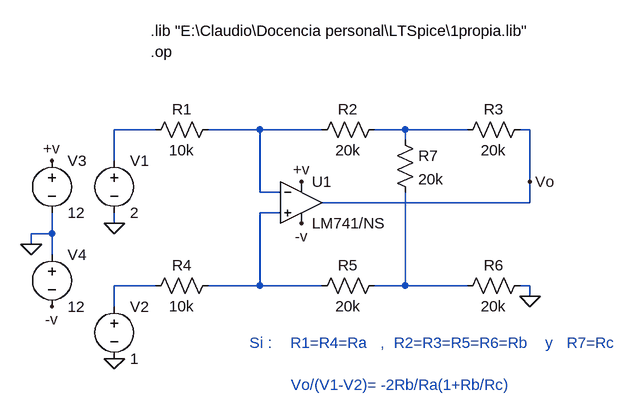
[diagram p0: schematic diferencial con derivacion.asc]
diferencial con derivacion.asc, the LTspice schematic file:
Version 4
SHEET 1 880 680
WIRE -16 64 -80 64
WIRE 144 64 64 64
WIRE 240 64 144 64
WIRE 368 64 320 64
WIRE 464 64 368 64
WIRE 560 64 544 64
WIRE 368 80 368 64
WIRE -80 112 -80 64
WIRE 560 144 560 64
WIRE 144 160 144 64
WIRE 176 160 144 160
WIRE 560 176 560 144
WIRE 560 176 240 176
WIRE 176 192 144 192
WIRE -80 208 -80 192
WIRE -176 224 -176 192
WIRE -176 224 -208 224
WIRE -208 240 -208 224
WIRE -176 256 -176 224
WIRE -16 304 -80 304
WIRE 144 304 144 192
WIRE 144 304 64 304
WIRE 240 304 144 304
WIRE 368 304 368 160
WIRE 368 304 320 304
WIRE 464 304 368 304
WIRE 560 304 544 304
WIRE 560 320 560 304
WIRE -80 336 -80 304
FLAG -208 240 0
FLAG -176 112 +v
FLAG 208 144 +v
FLAG -176 336 -v
FLAG 208 208 -v
FLAG 560 320 0
FLAG -80 208 0
FLAG -80 416 0
FLAG 560 144 Vo
DATAFLAG 448 176 ""
DATAFLAG -48 64 ""
SYMBOL OpAmps\\opamp2 208 112 R0
SYMATTR InstName U1
SYMATTR Value LM741/NS
SYMBOL voltage -176 96 R0
WINDOW 123 0 0 Left 0
WINDOW 39 0 0 Left 0
SYMATTR InstName V3
SYMATTR Value 12
SYMBOL voltage -176 240 R0
WINDOW 123 0 0 Left 0
WINDOW 39 0 0 Left 0
SYMATTR InstName V4
SYMATTR Value 12
SYMBOL res 80 48 R90
WINDOW 0 0 56 VBottom 2
WINDOW 3 32 56 VTop 2
SYMATTR InstName R1
SYMATTR Value 10k
SYMBOL res 336 48 R90
WINDOW 0 0 56 VBottom 2
WINDOW 3 32 56 VTop 2
SYMATTR InstName R2
SYMATTR Value 20k
SYMBOL res 560 48 R90
WINDOW 0 0 56 VBottom 2
WINDOW 3 32 56 VTop 2
SYMATTR InstName R3
SYMATTR Value 20k
SYMBOL res 80 288 R90
WINDOW 0 0 56 VBottom 2
WINDOW 3 32 56 VTop 2
SYMATTR InstName R4
SYMATTR Value 10k
SYMBOL res 336 288 R90
WINDOW 0 0 56 VBottom 2
WINDOW 3 32 56 VTop 2
SYMATTR InstName R5
SYMATTR Value 20k
SYMBOL res 560 288 R90
WINDOW 0 0 56 VBottom 2
WINDOW 3 32 56 VTop 2
SYMATTR InstName R6
SYMATTR Value 20k
SYMBOL voltage -80 96 R0
WINDOW 123 0 0 Left 0
WINDOW 39 0 0 Left 0
SYMATTR InstName V1
SYMATTR Value 2
SYMBOL voltage -80 320 R0
WINDOW 123 0 0 Left 0
WINDOW 39 0 0 Left 0
SYMATTR InstName V2
SYMATTR Value 1
SYMBOL res 352 64 R0
SYMATTR InstName R7
SYMATTR Value 20k
TEXT -24 -56 Left 2 !.op
TEXT -24 -88 Left 2 !.lib "E:\\Claudio\\Docencia personal\\LTSpice\\1propia.lib"
TEXT 128 392 Left 2 ;Si :    R1=R4=Ra   ,  R2=R3=R5=R6=Rb    y   R7=Rc
TEXT 192 456 Left 2 ;Vo/(V1-V2)= -2Rb/Ra(1+Rb/Rc)

The netlist it stands for:
* diferencial con derivacion.asc
XU1 N004 N002 +v -v Vo LM741/NS  ; pins In+ In- V+ V- OUT
V3 +v 0 12
V4 0 -v 12
R1 N002 N001 10k
R2 N003 N002 20k
R3 Vo N003 20k
R4 N004 N005 10k
R5 N006 N004 20k
R6 0 N006 20k
V1 N001 0 2
V2 N005 0 1
R7 N003 N006 20k
.op
.lib "E:\Claudio\Docencia personal\LTSpice\1propia.lib"
* Si :    R1=R4=Ra   ,  R2=R3=R5=R6=Rb    y   R7=Rc
* Vo/(V1-V2)= -2Rb/Ra(1+Rb/Rc)
.backanno
.end